# EAGLE schematic ARM_PDU (EAGLE 9.4.1)
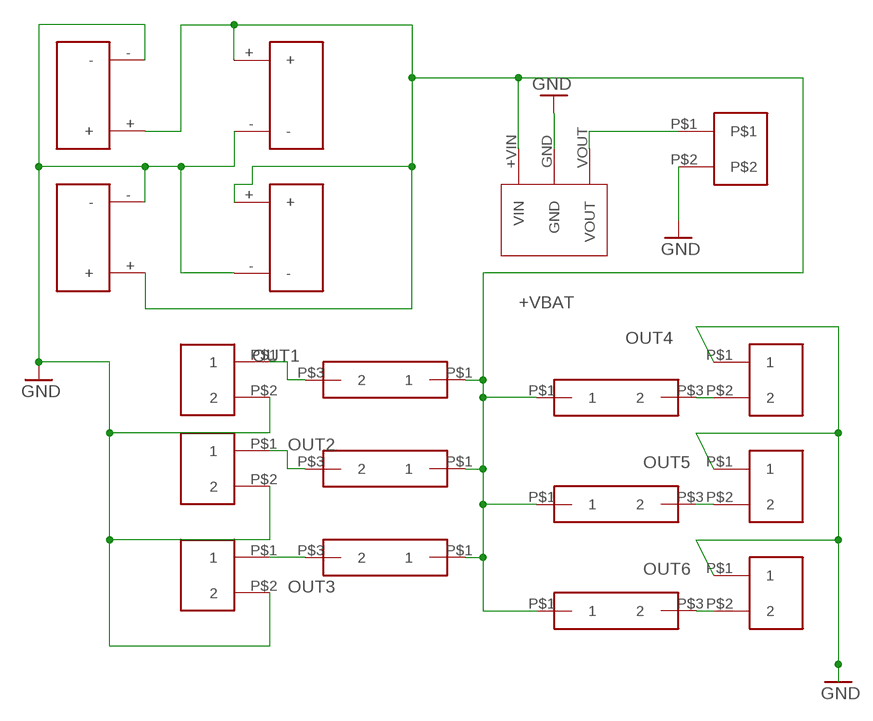
[diagram p0: schematic, sheet 1]

## Parts
U$1  20A_FUSE_HOLDER  [20A_FUSE_HOLDER]
U$2  20A_FUSE_HOLDER  [20A_FUSE_HOLDER]
U$3  20A_FUSE_HOLDER  [20A_FUSE_HOLDER]
U$4  PP45_HOR_2BOT  [PP45_HOR_2BOT]
U$5  PP45_HOR_2BOT  [PP45_HOR_2BOT]
U$6  PP45_HOR_2BOT  [PP45_HOR_2BOT]
U$7  PP45_HOR_2BOT  [PP45_HOR_2BOT]
U$8  AMP-MTE-2MALE  [AMP-MTE-2MALE]
U$9  R-78E3.3-0.5  [R-78E3.3-0.5]
U$10  2PIN_5MM  [2PIN_5MM]
U$11  2PIN_5MM  [2PIN_5MM]
U$12  2PIN_5MM  [2PIN_5MM]
U$13  2PIN_5MM  [2PIN_5MM]
U$14  20A_FUSE_HOLDER  [20A_FUSE_HOLDER]
U$15  20A_FUSE_HOLDER  [20A_FUSE_HOLDER]
U$16  20A_FUSE_HOLDER  [20A_FUSE_HOLDER]
U$17  2PIN_5MM  [2PIN_5MM]
U$18  2PIN_5MM  [2PIN_5MM]

## Nets
+VBAT: U$1.P$1 U$2.P$1 U$3.P$1 U$4.+ U$5.+ U$6.+ U$7.+ U$9.+VIN(VIN) U$14.P$1 U$15.P$1 U$16.P$1
GND: U$4.- U$5.- U$6.- U$7.- U$8.P$2 U$9.GND U$10.P$1 U$11.P$1 U$12.P$1 U$13.P$2 U$17.P$2 U$18.P$2
N$2: U$8.P$1 U$9.VOUT
OUT1: U$1.P$3 U$13.P$1
OUT2: U$2.P$3 U$17.P$1
OUT3: U$3.P$3 U$18.P$1
OUT4: U$10.P$2 U$16.P$3
OUT5: U$11.P$2 U$15.P$3
OUT6: U$12.P$2 U$14.P$3

## Library data of the parts
U$1-U$3 U$14-U$16 = 20A_FUSE_HOLDER:20A_FUSE_HOLDER
U$4-U$7 = SPEAR:PP45_HOR_2BOT
U$8 = SPEAR:AMP-MTE-2MALE
U$9 = SPEAR-PDU:R-78E3.3-0.5
U$10-U$13 U$17 U$18 = SPEAR-arm-pdu:2PIN_5MM